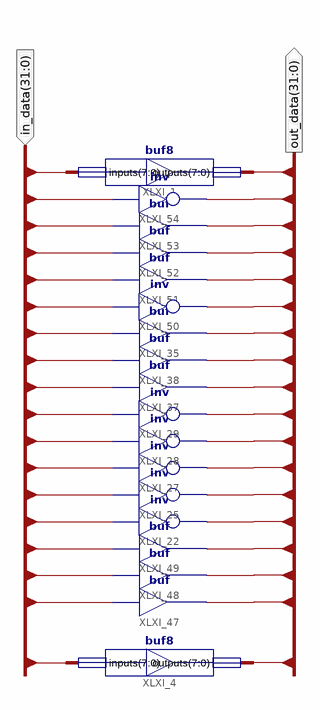
[diagram p0: schematic sheet 1]
// Xilinx ISE schematic encryptor.sch (spartan6) as structural Verilog: 18 symbols, 2 ports
module encryptor (
  input  [31:0] in_data,
  output [31:0] out_data
);

  buf8 XLXI_1 (.inputs(in_data[31:24]), .outputs(out_data[31:24]));
  buf XLXI_51 (out_data[20], in_data[23]);
  buf XLXI_52 (out_data[21], in_data[16]);
  buf XLXI_53 (out_data[22], in_data[12]);
  not XLXI_54 (out_data[23], in_data[18]);
  not XLXI_22 (out_data[11], in_data[15]);
  not XLXI_25 (out_data[12], in_data[17]);
  not XLXI_27 (out_data[13], in_data[8]);
  not XLXI_28 (out_data[14], in_data[20]);
  not XLXI_29 (out_data[15], in_data[19]);
  buf XLXI_37 (out_data[16], in_data[11]);
  buf XLXI_38 (out_data[17], in_data[14]);
  buf XLXI_35 (out_data[18], in_data[22]);
  buf XLXI_47 (out_data[8], in_data[9]);
  buf XLXI_48 (out_data[9], in_data[13]);
  buf XLXI_49 (out_data[10], in_data[21]);
  not XLXI_50 (out_data[19], in_data[10]);
  buf8 XLXI_4 (.inputs(in_data[7:0]), .outputs(out_data[7:0]));
endmodule
